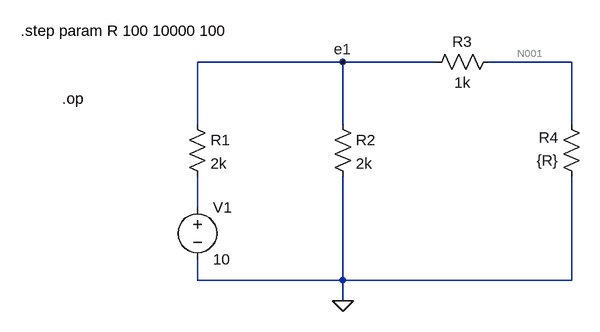
[diagram p0: schematic Lab4.asc]
Lab4.asc, the LTspice schematic file:
Version 4
SHEET 1 880 680
WIRE 144 -208 -80 -208
WIRE 288 -208 144 -208
WIRE 496 -208 368 -208
WIRE -80 -112 -80 -208
WIRE 144 -112 144 -208
WIRE 496 -112 496 -208
WIRE -80 16 -80 -32
WIRE -80 128 -80 96
WIRE 144 128 144 -32
WIRE 144 128 -80 128
WIRE 496 128 496 -32
WIRE 496 128 144 128
WIRE 144 160 144 128
FLAG 144 160 0
FLAG 144 -208 e1
SYMBOL voltage -80 0 R0
WINDOW 123 0 0 Left 0
WINDOW 39 0 0 Left 0
SYMATTR InstName V1
SYMATTR Value 10
SYMBOL res -96 -128 R0
SYMATTR InstName R1
SYMATTR Value 2k
SYMBOL res 128 -128 R0
SYMATTR InstName R2
SYMATTR Value 2k
SYMBOL res 384 -224 R90
WINDOW 0 0 56 VBottom 2
WINDOW 3 32 56 VTop 2
SYMATTR InstName R3
SYMATTR Value 1k
SYMBOL res 512 -16 R180
WINDOW 0 36 76 Left 2
WINDOW 3 36 40 Left 2
SYMATTR InstName R4
SYMATTR Value {R}
TEXT -288 -152 Left 2 !.op
TEXT -352 -256 Left 2 !.step param R 100 10000 100

The netlist it stands for:
* Lab4.asc
V1 N002 0 10
R1 e1 N002 2k
R2 e1 0 2k
R3 N001 e1 1k
R4 0 N001 {R}
.op
.step param R 100 10000 100
.backanno
.end

* Results of the author's LTspice run, read from the files saved beside the schematic
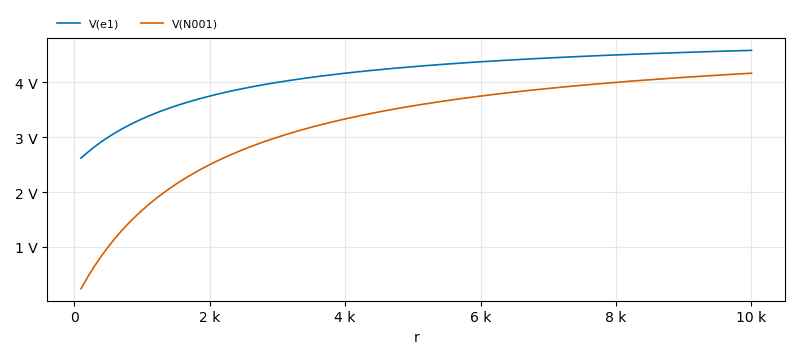
[diagram p1: Operating Point of Lab4.asc, plotted from the saved traces]
* Operating Point, 1 run:
*   V(e1): 2.619 V at r=100 , 4.583 V at r=10 k, min 2.619 V, max 4.583 V
*   V(N001): 238.1 mV at r=100 , 4.167 V at r=10 k, min 238.1 mV, max 4.167 V